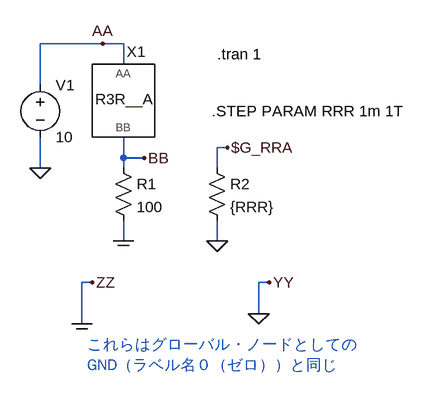
[diagram p0: schematic R3R_TEST.asc]
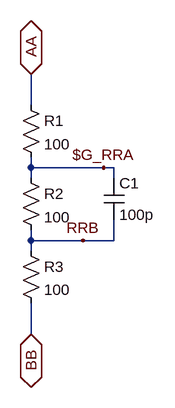
[diagram p1: sub-circuit r3r__a.asc]
R3R_TEST.asc, the LTspice schematic file:
Version 4
SHEET 1 880 680
WIRE 224 64 128 64
WIRE 256 64 224 64
WIRE 256 96 256 64
WIRE 128 128 128 64
WIRE 416 224 400 224
WIRE 256 240 256 208
WIRE 288 240 256 240
WIRE 128 256 128 208
WIRE 256 256 256 240
WIRE 400 256 400 224
WIRE 256 368 256 336
WIRE 400 368 400 336
WIRE 208 432 192 432
WIRE 480 432 464 432
WIRE 464 480 464 432
WIRE 192 496 192 432
FLAG 128 256 0
FLAG 400 368 0
FLAG 416 224 $G_RRA
FLAG 224 64 AA
FLAG 288 240 BB
FLAG 256 368 COM
FLAG 192 496 COM
FLAG 464 480 0
FLAG 208 432 ZZ
FLAG 480 432 YY
SYMBOL res 240 240 R0
SYMATTR InstName R1
SYMATTR Value 100
SYMBOL voltage 128 112 R0
WINDOW 123 0 0 Left 0
WINDOW 39 0 0 Left 0
SYMATTR InstName V1
SYMATTR Value 10
SYMBOL R3R__A 256 144 R0
WINDOW 0 20 -52 Bottom 2
WINDOW 39 2 21 Bottom 2
SYMATTR InstName X1
SYMATTR SpiceLine R3R__A
SYMBOL res 384 240 R0
SYMATTR InstName R2
SYMATTR Value {RRR}
TEXT 400 80 Left 2 !.tran 1
TEXT 392 168 Left 2 !.STEP PARAM RRR 1m 1T
TEXT 200 528 Left 2 ;これらはグローバル・ノードとしての\nGND（ラベル名０（ゼロ））と同じ

r3r__a.asc, the sub-circuit schematic file:
Version 4
SHEET 1 880 680
WIRE 80 144 80 96
WIRE 80 240 80 224
WIRE 192 240 80 240
WIRE 208 240 192 240
WIRE 80 256 80 240
WIRE 208 256 208 240
WIRE 80 352 80 336
WIRE 160 352 80 352
WIRE 208 352 208 320
WIRE 208 352 160 352
WIRE 80 368 80 352
WIRE 80 496 80 448
FLAG 192 240 $G_RRA
FLAG 160 352 RRB
FLAG 80 96 AA
IOPIN 80 96 BiDir
FLAG 80 496 BB
IOPIN 80 496 BiDir
SYMBOL res 64 128 R0
SYMATTR InstName R1
SYMATTR Value 100
SYMBOL res 64 240 R0
SYMATTR InstName R2
SYMATTR Value 100
SYMBOL res 64 352 R0
SYMATTR InstName R3
SYMATTR Value 100
SYMBOL cap 192 256 R0
SYMATTR InstName C1
SYMATTR Value 100p

The netlist it stands for:
* R3R_TEST.asc
R1 BB ZZ 100
V1 AA 0 10
XX1 AA BB r3r__a params: R3R__A
R2 $G_RRA 0 {RRR}

* block symbol definitions
.subckt r3r__a AA BB
R1 AA $G_RRA 100
R2 $G_RRA RRB 100
R3 RRB BB 100
C1 $G_RRA RRB 100p
.ends r3r__a

.tran 1
.STEP PARAM RRR 1m 1T
* これらはグローバル・ノードとしての
* GND（ラベル名０（ゼロ））と同じ
.backanno
.end